# EAGLE schematic XCVR (EAGLE 6.5.0)
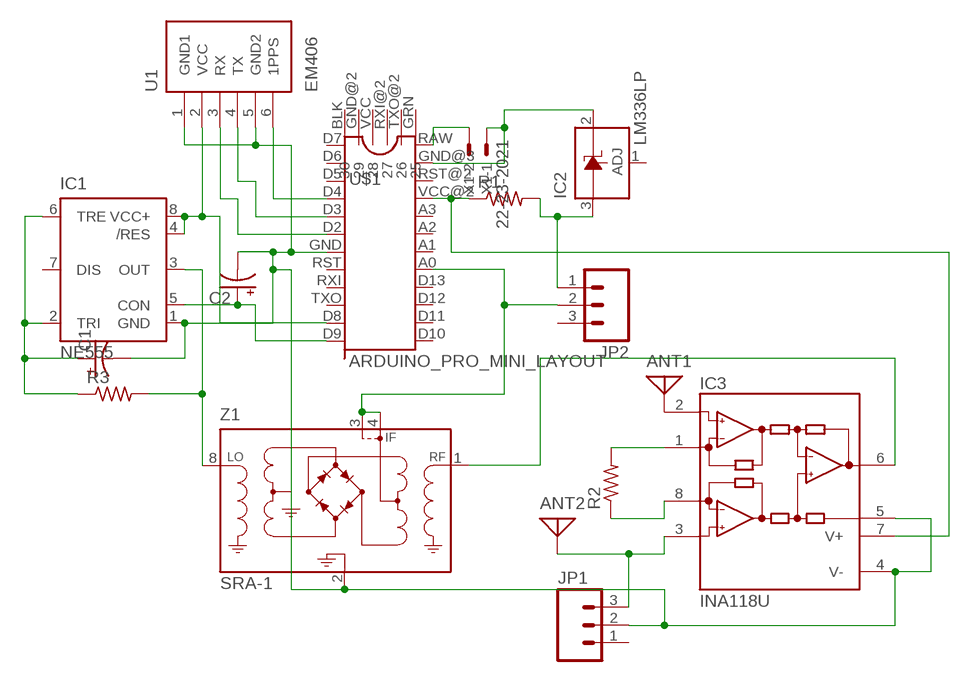
[diagram p0: schematic, sheet 1]

## Parts
ANT1  ANTENNA  [PAD-01]
ANT2  ANTENNA  [PAD-01]
C1  CPOL-USE2,5-6E  [E2,5-6E]
C2  CPOL-USE2,5-6E  [E2,5-6E]
IC1  NE555  [DIL-08]
IC2  LM336LP  [TO92]
IC3  INA118U  [SO08]
JP1  M03PTH  [1X03]
JP2  M03PTH  [1X03]
R1  R-US_0204/5  [0204/5]
R2  R-US_0204/5  [0204/5]
R3  R-US_0204/5  [0204/5]
U1  EM406  [EM406]
U$1  ARDUINO_PRO_MINI_LAYOUT  [ARDUINO_PRO_MINI_PINOUT]
X1  22-23-2021  [22-23-2021]
Z1  SRA-1  [A01]

## Nets
GND: C1.- C2.- IC1.1(GND) IC3.4(V-) IC3.5(REF) JP1.2 U1.1(GND1) U1.5(GND2) U$1.GND Z1.2(CASEGROUND)
N$1: C2.+ IC1.5(CON) U$1.D9
N$3: IC1.4(/RES) IC1.8(VCC+) U1.2(VCC) U$1.D8
N$4: IC1.3(OUT) R3.2 Z1.8(L)
N$5: JP2.2 U$1.A0 Z1.3(IF) Z1.4(IF)
N$6: IC2.2(C) U$1.GND@3 X1.1
N$8: ANT1.1 IC3.2(-IN)
N$9: IC3.1(RG) R2.2
N$10: IC3.8(RG) R2.1
N$11: ANT2.1 IC3.3(+IN) JP1.3
N$12: IC3.6(OUT) Z1.1(R)
N$14: IC3.7(V+) R1.1 U$1.VCC@2
N$15: C1.+ IC1.2(TRI) IC1.6(TRE) R3.1
N$16: IC2.3(A) JP2.1 R1.2
N$18: U1.3(RX) U$1.D2
N$19: U1.4(TX) U$1.D3
N$20: U$1.RAW X1.2
N$21: U1.6(1PPS) U$1.D4
Unconnected: IC1.7(DIS) IC2.1(ADJ) JP1.1 JP2.3 U$1.A1 U$1.A2 U$1.A3 U$1.BLK U$1.D5 U$1.D6 U$1.D7 U$1.D10 U$1.D11 U$1.D12 U$1.D13 U$1.GND@2 U$1.GRN U$1.RST U$1.RST@2 U$1.RXI U$1.RXI@2 U$1.TXO U$1.TXO@2 U$1.VCC

## Power pins joined to a net without a drawn wire
GND: Z1.5(GND) Z1.6(GND) Z1.7(GND)

## Library data of the parts
ANT1 ANT2 = discrete:ANTENNA: Antenna
C1 C2 = rcl:CPOL-US: POLARIZED CAPACITOR, American symbol
IC1 = st-microelectronics:NE555: General purpose bipolar Timer; MF: Arrow Electronics; MPN: NE555N; OC_FARNELL: 1467742; OC_NEWARK: 89K1486
IC2 = linear:LM336: 2.5-V INTEGRATED REFERENCE CIRCUITS LM236 Source: http://focus.ti.com/lit/ds/symlink/lm336-2.5.pdf
IC3 = burr-brown:INA118: Instrumentation Amplifier Precision, Low Power; MF: TEXAS INSTRUMENTS; MPN: INA118U; OC_FARNELL: 1212404; OC_NEWARK: 04M6168
JP1 JP2 = SparkFun-Connectors:M03: Header 3 Standard 3-pin 0.1" header. Use with straight break away headers (SKU : PRT-00116), right angle break away headers (PRT-00553), swiss pins (PRT-00743), machine pins (PRT-00117), and female headers (PRT-00115). Molex polarized connector foot print use with SKU : PRT-08232 with associated crimp pins and housings.
R1-R3 = rcl:R-US_: RESISTOR, American symbol
U1 = SparkFun-Connectors:EM406: EM406 GPS Connector Proven layout and schematic for EM406 connector. Spark Fun Electronics SKU : GPS-00579
U$1 = ArduinoProMini:ARDUINO_PRO_MINI_LAYOUT
X1 = con-molex:22-23-2021: .100" (2.54mm) Center Header - 2 Pin; MF: MOLEX; MPN: 22-23-2021; OC_FARNELL: 1462926; OC_NEWARK: 25C3832
Z1 = minicircuits:SRA-1: Frequency Mixer Level 7 (LO Power + 7 dBm) Source: minicircuits.com .. SRA-1+.pdf; OC_FARNELL: unknown; OC_NEWARK: unknown